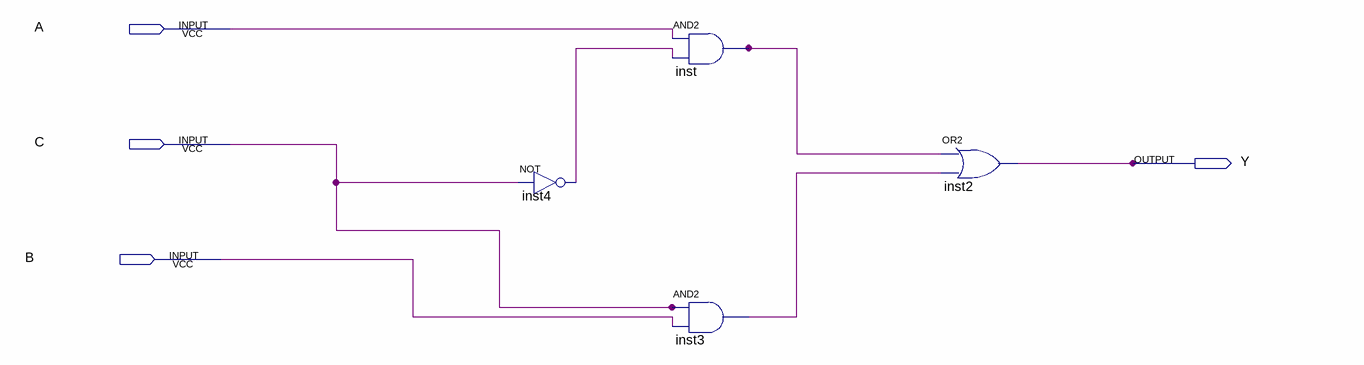
[diagram p0: schematic sheet]
// Quartus schematic Shohag_mux221.bdf as structural Verilog: 4 symbols, 4 pins
module Shohag_mux221 (
  input  A,
  input  C,
  input  B,
  output Y
);

  wire inst3_out, inst4_out, inst_out;

  not inst4 (inst4_out, C);
  and inst (inst_out, A, inst4_out);
  and inst3 (inst3_out, C, B);
  or inst2 (Y, inst_out, inst3_out);
endmodule
